# Altium schematic sheet 02_Power.SchDoc
size A; SheetNumber: 2; SheetTotal: 3
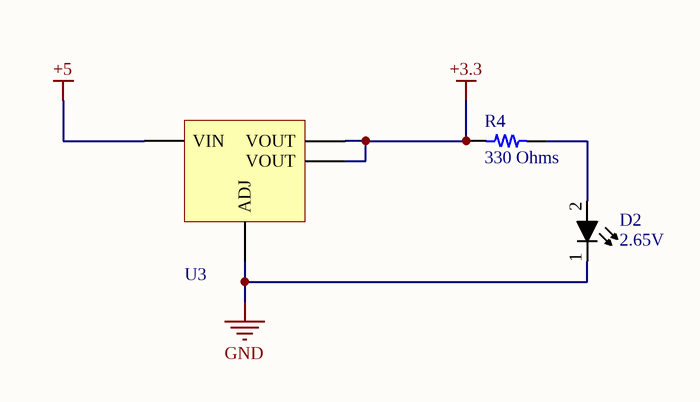
[diagram p0: 02_Power.SchDoc]

## Parts
D2  Forward Voltage: 2.65V  [chip_0603_LED]  (hidden comment: diode_4)
R4  330 Ohms  [RES 0603_1608]
U3  LM1117  [sot-223-4]  (value not drawn)

## Nets
+3.3: R4.1 U3.2(VOUT) U3.4(VOUT)
+5: U3.3(VIN)
GND: D2.1 U3.1(ADJ)
NetD2_2: D2.2 R4.2

## Library data of the parts
D2 = DIO-00050: LED, Green, 0603, Low current, HELI2 Series; Manufacturer: Kingbright; Manufacturer PN: APT1608LZGCK; Reverse Breakdown Voltage: 5V; Current Rating: 30mA; Power Rating: 120mW; Type: LED; Part Number: DIO-00050; Cost: 0.58
R4 = RK73B1JTTD331J: RES 330 OHM 5% 1/8W 0603; Manufacturer: KOA Speer Electronics, Inc.; Power (Watts): 0.125W, 1/8W; Temperature Coefficient: ±200ppm/°C; Part Number: RK73B1JTTD331J; Value: 330 Ohms; ComponentLink1Description: Datasheet; ComponentLink1URL: http://www.koaspeer.com/catimages/Products/RK73B/RK73B.pdf; ComponentLink2Description: DigiKey Link; ComponentLink2URL: http://digikey.com/product-detail/en/koa-speer-electronics-inc/RK73B1JTTD331J/2019-RK73B1JTTD331JCT-ND/9846751; Composition: Thick Film; Device Package: 0603 (1608 Metric); Features: Automotive AEC-Q200, Moisture Resistant; Height - Seated (Max): 0.022" (0.55mm); LastUpdated: 9/2/2020 1:10:22 AM; Lifecycle Status: Active; Minimum Order: 1; Number of Terminations: 2; Operating Temperature: -55°C ~ 155°C; Package / Case: 0603 (1608 Metric); Packaging: CutTape; PartId: 5985; Part Status: Active; Price: 0.10; Ratings: AEC-Q200; Resistance: 330 Ohms; Series: RK73B; Size / Dimension: 0.063" L x 0.031" W (1.60mm x 0.80mm); Supplier 1: DigiKey; Supplier Part Number 1: 2019-RK73B1JTTD331JCT-ND; Supplier Device Package: 0603; Tolerance: ±5%
U3 = PWREG-00018: REG, Linear, Fixed 3V3, 800mA, SOT-223; Manufacturer: TI; Manufacturer PN: LM1117MPX-3.3/NOPB; Voltage Range In: 4.5 - 15V; Voltage Range Out: 3.3V; Part Number: PWREG-00018; Max Current: 800mA; Reg Type: Linear; Fixed/Adj: Fixed; Cost: 1.14